# Altium schematic sheet IntelligentCarFor51SchDoc.SchDoc
size B
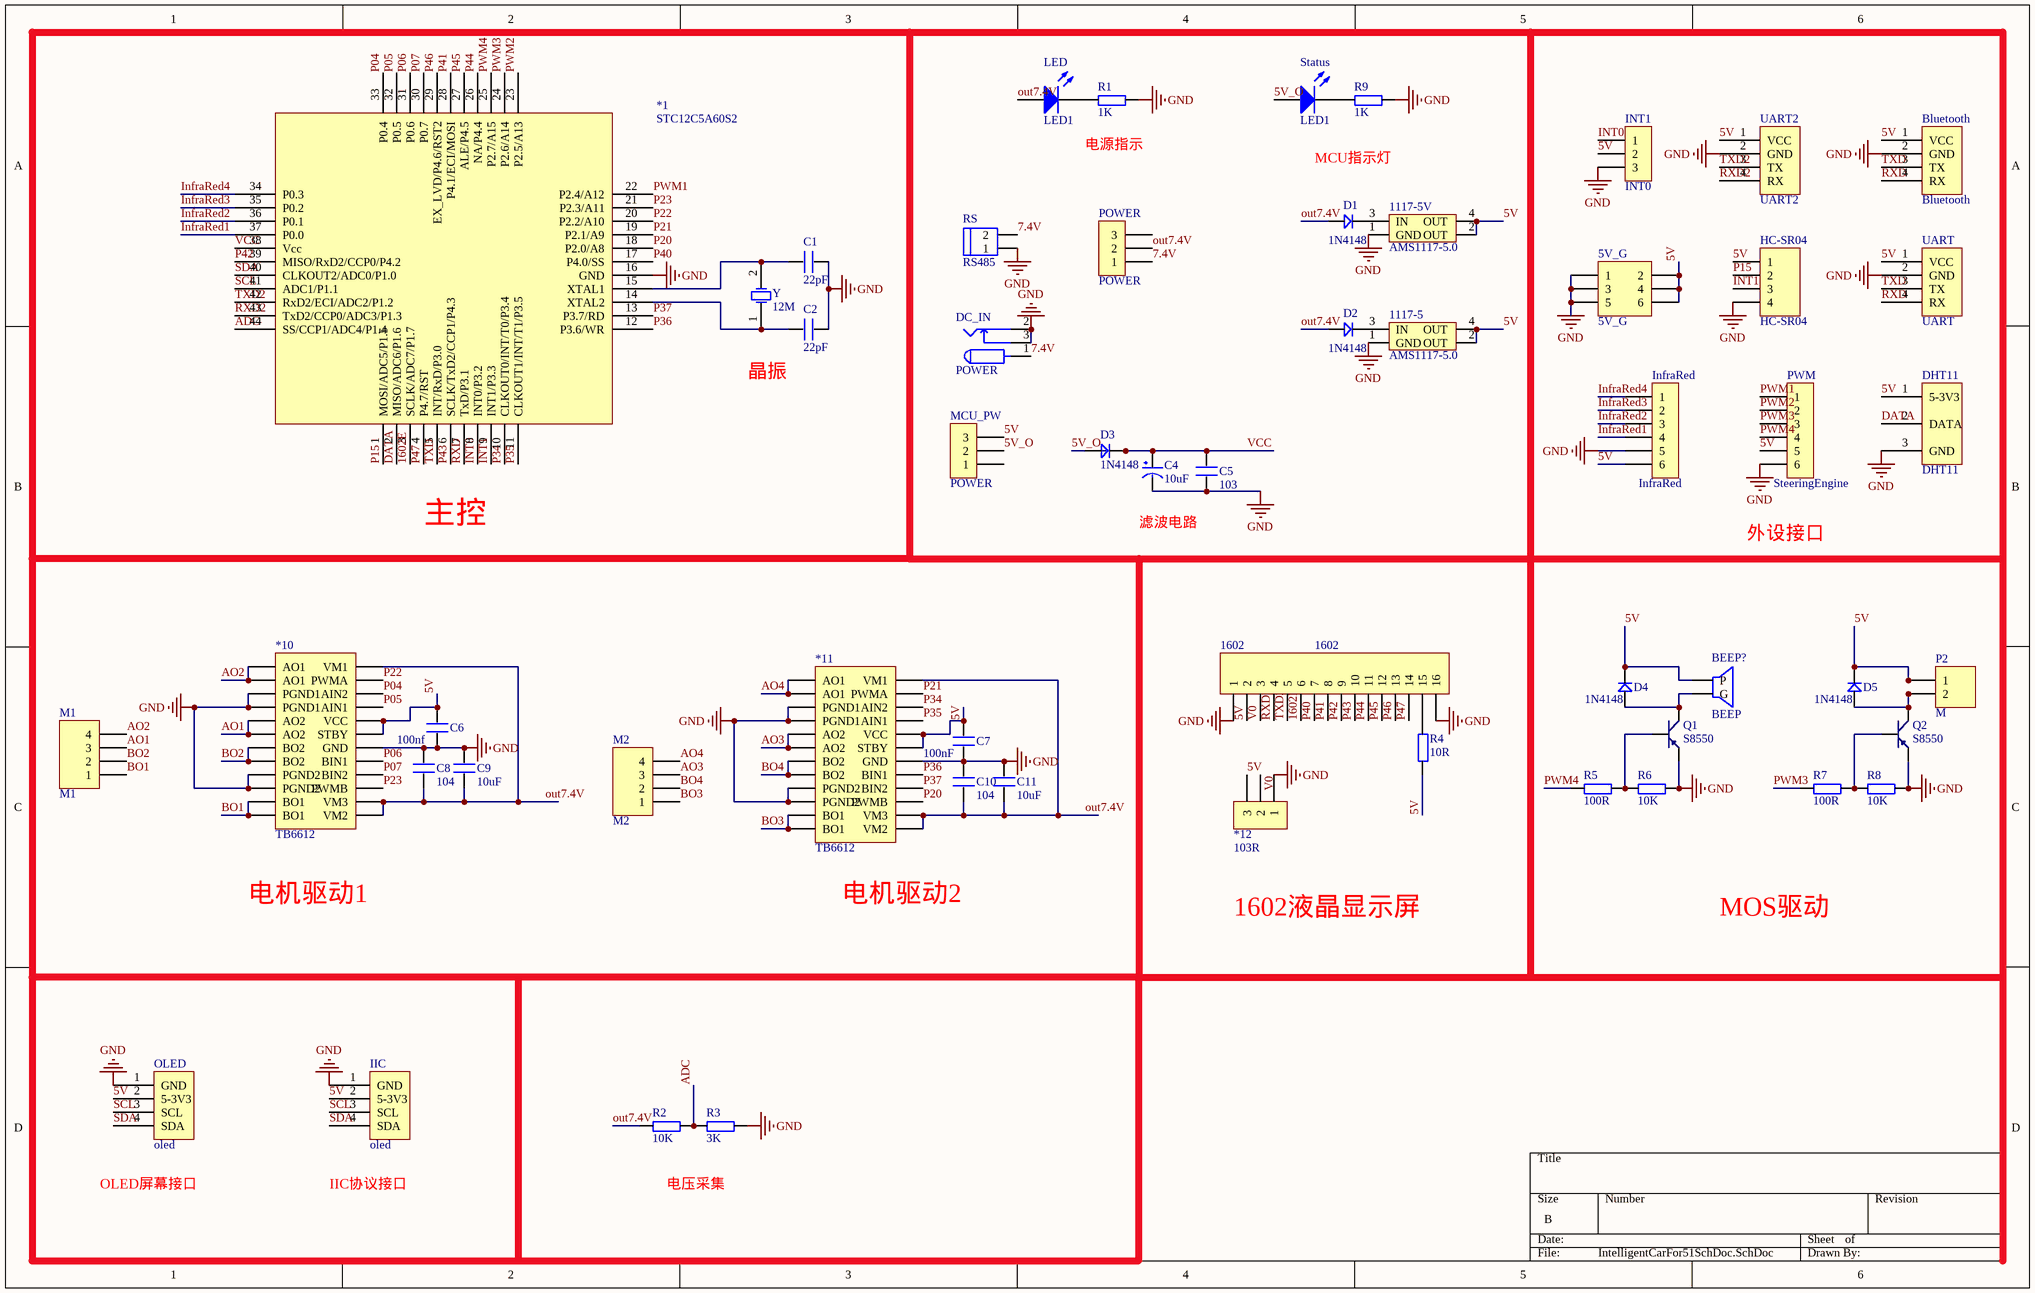
[diagram p0: IntelligentCarFor51SchDoc.SchDoc]

## Parts
5V_G  5V_G  [HDR2X3]
1117-5  AMS1117-5.0  [AMS1117]
1117-5V  AMS1117-5.0  [AMS1117]
1602  1602  [HDR1X16]
*1  STC12C5A60S2  [LQFP-44]
*10  TB6612  [TSOP65P760X120-24N]
*11  TB6612  [TSOP65P760X120-24N]
*12  103R  [R_change]
BEEP?  BEEP  [BELL-5]
Bluetooth  Bluetooth  [HDR1X4]
C1  22pF  [0603P]
C2  22pF  [0603P]
C4  10uF  [Cap10uF]
C5  103  [0603P]
C6  100nf  [0603P]
C7  100nF  [0603P]
C8  104  [0603P]
C9  10uF  [0603P]
C10  104  [0603P]
C11  10uF  [0603P]
D1  1N4148  [DIODE_3*5.3]
D2  1N4148  [DIODE_3*5.3]
D3  1N4148  [DIODE_SOP]
D4  1N4148  [DIODE_SOP]
D5  1N4148  [DIODE_SOP]
DC_IN  POWER  [DC10B]
DHT11  DHT11  [header1*3]
HC-SR04  HC-SR04  [HDR1X4]
IIC  oled  [HDR1X4]
InfraRed  InfraRed  [header1*6]
INT1  INT0  [header1*3]
LED  LED1  [SMDLED]
M1  M1  [HDR1X4]
M2  M2  [HDR1X4]
MCU_PW  POWER  [header1*3]
OLED  oled  [HDR1X4]
P2  M  [HDR1X2]
POWER  POWER  [header1*3]
PWM  SteeringEngine  [HEAD3*4]
Q1  S8550  [SOT-23R]
Q2  S8550  [SOT-23R]
R1  1K  [0603P]
R2  10K  [0603P]
R3  3K  [0603P]
R4  10R  [0805]
R5  100R  [0603P]
R6  10K  [0603P]
R7  100R  [0603P]
R8  10K  [0603P]
R9  1K  [0603P]
RS  RS485  [HEAD2L-0.8]
Status  LED1  [SMDLED]
UART  UART  [HDR1X4]
UART2  UART2  [HDR1X4]
Y  12M  [XTAL_US]

## Nets
GND: 5V_G.1 5V_G.3 5V_G.5 1117-5.1(GND) 1117-5V.1(GND) 1602.1 1602.16 *1.16(GND) *10.3(PGND1) *10.4(PGND1) *10.9(PGND2) *10.10(PGND2) *10.18(GND) *11.3(PGND1) *11.4(PGND1) *11.9(PGND2) *11.10(PGND2) *11.18(GND) *12.1 Bluetooth.2(GND) C1.2 C2.2 C4.2(GND) C5.1 C6.1 C7.1 C8.2 C9.2 C10.2 C11.2 DC_IN.2 DC_IN.3 DHT11.3(GND) HC-SR04.4 IIC.1(GND) InfraRed.5 INT1.3 OLED.1(GND) PWM.6 Q1.1(E) Q2.1(E) R1.2 R3.2 R6.2 R8.2 R9.2 RS.1 UART.2(GND) UART2.2(GND)
5V: 5V_G.2 5V_G.4 5V_G.6 1117-5.2(OUT) 1117-5.4(OUT) 1117-5V.2(OUT) 1117-5V.4(OUT) 1602.2 *10.19(STBY) *10.20(VCC) *11.19(STBY) *11.20(VCC) *12.3 BEEP?.1(P) Bluetooth.1(VCC) C6.2 C7.2 D4.2 D5.2 DHT11.1(5-3V3) HC-SR04.1 IIC.2(5-3V3) InfraRed.6 INT1.2 MCU_PW.3 OLED.2(5-3V3) P2.1 PWM.5 R4.1 UART.1(VCC) UART2.1(VCC)
5V_O: D3.1 MCU_PW.2 Status.1(A)
7.4V: DC_IN.1 POWER.1 RS.2
1602E: 1602.6 *1.3(SCLK/ADC7/P1.7)
ADC: *1.44(SS/CCP1/ADC4/P1.4) R2.2 R3.1
AO1: *10.5(AO2) *10.6(AO2) M1.3
AO2: *10.1(AO1) *10.2(AO1) M1.4
AO3: *11.5(AO2) *11.6(AO2) M2.3
AO4: *11.1(AO1) *11.2(AO1) M2.4
BO1: *10.11(BO1) *10.12(BO1) M1.1
BO2: *10.7(BO2) *10.8(BO2) M1.2
BO3: *11.11(BO1) *11.12(BO1) M2.1
BO4: *11.7(BO2) *11.8(BO2) M2.2
DATA: *1.2(MISO/ADC6/P1.6) DHT11.2(DATA)
InfraRed1: *1.37(P0.0) InfraRed.4
InfraRed2: *1.36(P0.1) InfraRed.3
InfraRed3: *1.35(P0.2) InfraRed.2
InfraRed4: *1.34(P0.3) InfraRed.1
INT0: *1.8(INT0/P3.2) INT1.1
INT1: *1.9(INT1/P3.3) HC-SR04.3
out7.4V: *10.13(VM2) *10.14(VM3) *10.24(VM1) *11.13(VM2) *11.14(VM3) *11.24(VM1) C8.1 C9.1 C10.1 C11.1 D1.1 D2.1 LED.1(A) POWER.2 R2.1
P04: *1.33(P0.4) *10.22(AIN2)
P05: *1.32(P0.5) *10.21(AIN1)
P06: *1.31(P0.6) *10.17(BIN1)
P07: *1.30(P0.7) *10.16(BIN2)
P15: *1.1(MOSI/ADC5/P1.5) HC-SR04.2
P20: *1.18(P2.0/A8) *11.15(PWMB)
P21: *1.19(P2.1/A9) *11.23(PWMA)
P22: *1.20(P2.2/A10) *10.23(PWMA)
P23: *1.21(P2.3/A11) *10.15(PWMB)
P34: *1.10(CLKOUT0/INT/T0/P3.4) *11.22(AIN2)
P35: *1.11(CLKOUT1/INT/T1/P3.5) *11.21(AIN1)
P36: *1.12(P3.6/WR) *11.17(BIN1)
P37: *1.13(P3.7/RD) *11.16(BIN2)
P40: 1602.7 *1.17(P4.0/SS)
P41: 1602.8 *1.28(P4.1/ECI/MOSI)
P42: 1602.9 *1.39(MISO/RxD2/CCP0/P4.2)
P43: 1602.10 *1.6(SCLK/TxD2/CCP1/P4.3)
P44: 1602.11 *1.26(NA/P4.4)
P45: 1602.12 *1.27(ALE/P4.5)
P46: 1602.13 *1.29(EX_LVD/P4.6/RST2)
P47: 1602.14 *1.4(P4.7/RST)
PWM1: *1.22(P2.4/A12) PWM.1
PWM2: *1.23(P2.5/A13) PWM.2
PWM3: *1.24(P2.6/A14) PWM.3 R7.1
PWM4: *1.25(P2.7/A15) PWM.4 R5.1
RXD: *1.7(TxD/P3.1) Bluetooth.4(RX) UART.4(RX)
RXD2: 1602.4 *1.43(TxD2/CCP0/ADC3/P1.3) UART2.4(RX)
SCL: *1.41(ADC1/P1.1) IIC.3(SCL) OLED.3(SCL)
SDA: *1.40(CLKOUT2/ADC0/P1.0) IIC.4(SDA) OLED.4(SDA)
TXD: *1.5(INT/RxD/P3.0) Bluetooth.3(TX) UART.3(TX)
TXD2: 1602.5 *1.42(RxD2/ECI/ADC2/P1.2) UART2.3(TX)
V0: 1602.3 *12.2
VCC: *1.38(Vcc) C4.1(VCC) C5.2 D3.2
Net1117-5_3: 1117-5.3(IN) D2.2
Net1117-5V_3: 1117-5V.3(IN) D1.2
Net1602_15: 1602.15 R4.2
Net*1_14: *1.14(XTAL2) C2.1 Y.1(OSC1)
Net*1_15: *1.15(XTAL1) C1.1 Y.2(OSC2)
NetBEEP?_2: BEEP?.2(G) D4.1 Q1.3(C)
NetD5_1: D5.1 P2.2 Q2.3(C)
NetLED_2: LED.2(K) R1.1
NetQ1_2: Q1.2(B) R5.2 R6.1
NetQ2_2: Q2.2(B) R7.2 R8.1
NetR9_1: R9.1 Status.2(K)

Not connected (* = marked no-connect by the designer): MCU_PW 1; POWER 3

## Notes on the sheet
- 电源指示
- MCU指示灯
- 晶振
- 主控
- 滤波电路
- 外设接口
- 电机驱动1
- (near *11) 电机驱动2
- 1602液晶显示屏
- MOS驱动
- (near OLED) OLED屏幕接口
- (near IIC) IIC协议接口
- 电压采集

## Library data of the parts
5V_G = Header 3X2: Header, 3-Pin, Dual row; LatestRevisionDate: 17-Jul-2002; LatestRevisionNote: Re-released for DXP Platform.; Publisher: Altium Limited
1117-5 1117-5V = AMS1117
1602 = Header 16: Header, 16-Pin; LatestRevisionDate: 17-Jul-2002; LatestRevisionNote: Re-released for DXP Platform.; Publisher: Altium Limited
*12 INT1 MCU_PW POWER = header3*1
Bluetooth UART UART2 = Header4booth
C1 C2 C5-C11 = C
C4 = CAP
D1-D5 = D
DC_IN = POW
DHT11 = DHT11_2
HC-SR04 M1 M2 = Header 4: Header, 4-Pin; LatestRevisionDate: 17-Jul-2002; LatestRevisionNote: Re-released for DXP Platform.; Publisher: Altium Limited
InfraRed PWM = header1*6
LED Status = LED2: Typical RED, GREEN, YELLOW, AMBER GaAs LED; Published: 8-Jun-2000; LatestRevisionDate: 17-Jul-2002; LatestRevisionNote: Re-released for DXP Platform.; PackageDocument: Feb-2002; PackageReference: 3.2X1.6X1.1; Publisher: Altium Limited
P2 = Header 2: Header, 2-Pin; LatestRevisionDate: 17-Jul-2002; LatestRevisionNote: Re-released for DXP Platform.; Publisher: Altium Limited
Q1 Q2 = PNP: 8550/BCW68
R1-R9 = R
RS = HEAD2
Y = XTAL: Crystal Oscillator; Published: 8-Jun-2000; LatestRevisionDate: 17-Jul-2002; LatestRevisionNote: Re-released for DXP Platform.; Publisher: Altium Limited